# Altium schematic sheet SDCARD.SchDoc
size A4; SheetNumber: 4; SheetTotal: 7
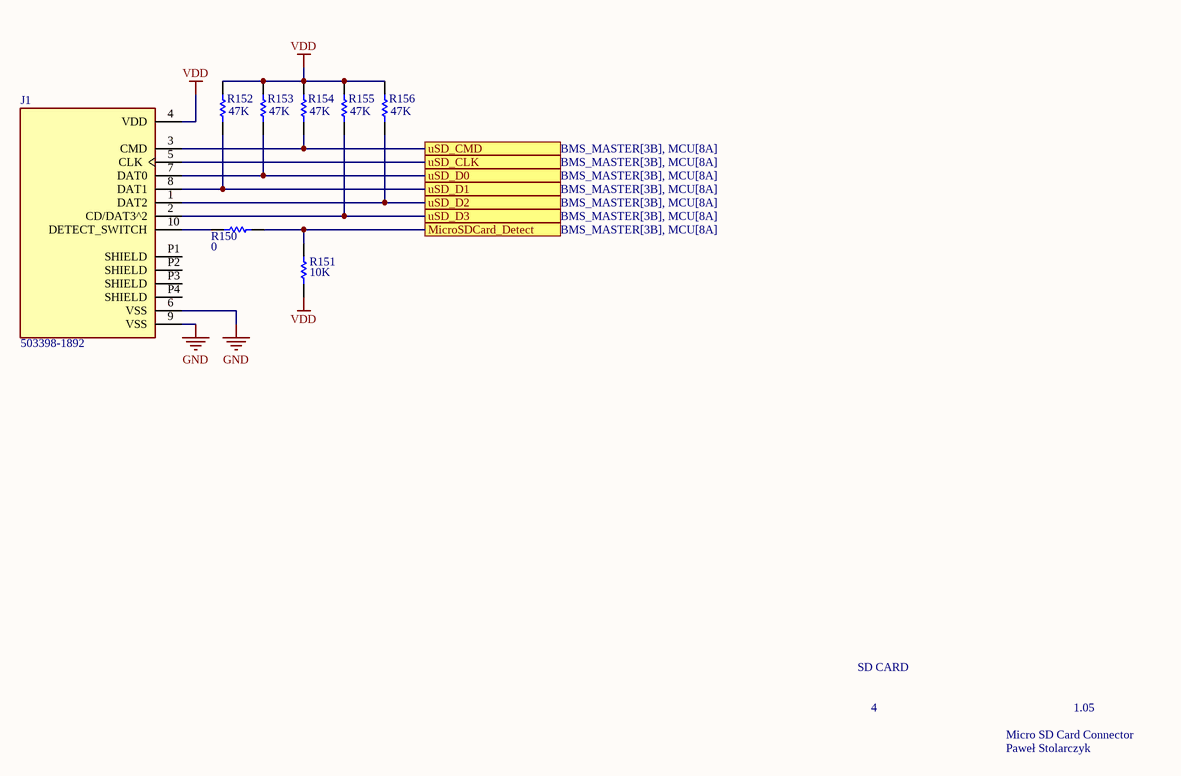
[diagram p0: SDCARD.SchDoc]

## Parts
J1  503398-1892  [MOLEX_503398-1892]
R150  value 0  [0402]  (hidden comment: Res1)
R151  value 10K  [0402]  (hidden comment: Res1)
R152  value 47K  [0402]  (hidden comment: Res1)
R153  value 47K  [0402]  (hidden comment: Res1)
R154  value 47K  [0402]  (hidden comment: Res1)
R155  value 47K  [0402]  (hidden comment: Res1)
R156  value 47K  [0402]  (hidden comment: Res1)

## Ports
MicroSDCard_Detect (see BMS_MASTER[3B], MCU[8A]), uSD_CLK (see BMS_MASTER[3B], MCU[8A]), uSD_CMD (see BMS_MASTER[3B], MCU[8A]), uSD_D0 (see BMS_MASTER[3B], MCU[8A]), uSD_D1 (see BMS_MASTER[3B], MCU[8A]), uSD_D2 (see BMS_MASTER[3B], MCU[8A]), uSD_D3 (see BMS_MASTER[3B], MCU[8A])

## Nets
GND: J1.6(VSS) J1.9(VSS)
VDD: J1.4(VDD) R151.2 R152.2 R153.2 R154.2 R155.2 R156.2
MicroSDCard_Detect: R150.2 R151.1 ; port MicroSDCard_Detect
uSD_CLK: J1.5(CLK) ; port uSD_CLK
uSD_CMD: J1.3(CMD) R154.1 ; port uSD_CMD
uSD_D0: J1.7(DAT0) R153.1 ; port uSD_D0
uSD_D1: J1.8(DAT1) R152.1 ; port uSD_D1
uSD_D2: J1.1(DAT2) R156.1 ; port uSD_D2
uSD_D3: J1.2(CD/DAT3^2) R155.1 ; port uSD_D3
NetJ1_10: J1.10(DETECT_SWITCH) R150.1

Not connected (* = marked no-connect by the designer): J1 P1(SHIELD) P2(SHIELD) P3(SHIELD) P4(SHIELD)

## Notes on the sheet
- SD CARD
- 4
- Micro SD Card Connector
- 1.05
- Paweł Stolarczyk

## Library data of the parts
J1 = 503398-1892: 9 (8 + 1) Position Card Connector Secure Digital - microSDâ„¢ Surface Mount, Right Angle Gold; MP: 5033981892; MF: Molex; Check_prices: https://www.snapeda.com/parts/5033981892/Molex/view-part/?ref=eda; Value: *; Availability: In Stock; Price: None; Package: None; SnapEDA_Link: https://www.snapeda.com/parts/5033981892/Molex/view-part/?ref=snap; Purchase-URL: https://pricing.snapeda.com/search/part/5033981892/?ref=eda
R150-R156 = Res1: Resistor; Published: 8-Jun-2000; LatestRevisionDate: 17-Jul-2002; LatestRevisionNote: Re-released for DXP Platform.; PackageReference: AXIAL-0.3; Publisher: Altium Limited; PackageDescription: Axial Device, Thru-Hole; 2 Leads; 0.3 in Pin Spacing